# Altium schematic sheet 基于32的人体健康检测系统.SchDoc
size A4
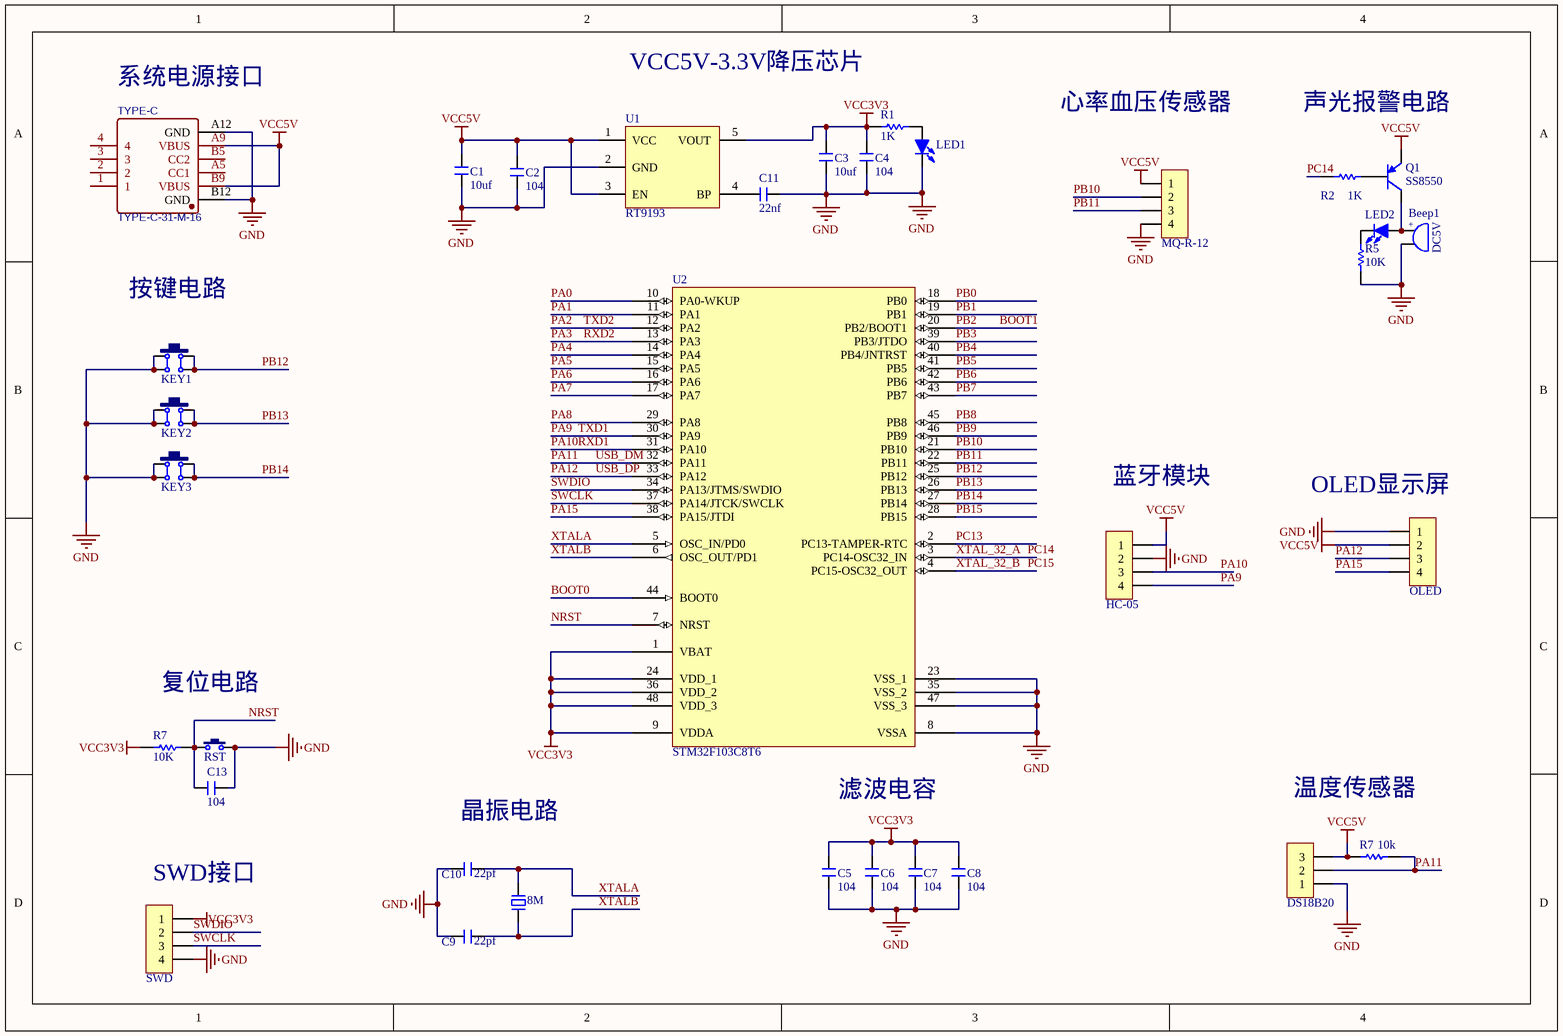
[diagram p0: 基于32的人体健康检测系统.SchDoc]

## Parts
(Parts that share a designator on the sheet are numbered #1, #2 ... from top to bottom, then left to right.)
8M  (no value)  [XTAL-2X6]
Beep1  DC5V  [BEEP 5x9x5.5]
C1  10uf  [C 0603]
C2  104  [C 0603]
C3  10uf  [C 0603]
C4  104  [C 0603]
C5  104  [C 0603]
C6  104  [C 0603]
C7  104  [C 0603]
C8  104  [C 0603]
C9  22pf  [C 0603]
C10  22pf  [C 0603]
C11  22nf  [C 0603]
C13  104  [C 0603]
DS18B20  HDR-1X3  [HDR-1X3]  (value not drawn)
HC-05  HDR-1X4  [HDR-1X4]  (value not drawn)
KEY1  6x6x5  [TSW DIP-6*6*6]  (value not drawn)
KEY2  6x6x5  [TSW DIP-6*6*6]  (value not drawn)
KEY3  6x6x5  [TSW DIP-6*6*6]  (value not drawn)
LED1  (no value)  [LED 0603G]
LED2  (no value)  [I-LED-3MM]
MQ-R-12  HDR-1X4  [HDR-1X4]  (value not drawn)
OLED  HDR-1X4  [OLED_IIC]  (value not drawn)
Q1  SS8550  [TO92A]
R1  1K  [R 0603]
R2  1K  [AL0204]
R5  10K  [AL0204]
R7#1  10K  [R 0603]
R7#2  10k  [AL0204]
RST  3x6x5  [TSW SMD-3*4*2]  (value not drawn)
SWD  HDR-1X4  [HDR-1X4]  (value not drawn)
TYPE-C  TYPE-C-31-M-16  [Type-c-5P]
U1  RT9193  [SOT23-5M]
U2  STM32F103C8T6  [LQFP48 7X7_M]

## Nets
GND: Beep1.2 C1.2 C2.2 C3.2 C4.2 C5.2 C6.2 C7.2 C8.2 C9.1 C10.1 C11.2 C13.1 DS18B20.1 HC-05.2 KEY1.1 KEY1.4 KEY2.1 KEY2.4 KEY3.1 KEY3.4 LED1.2(K) MQ-R-12.4 OLED.1 R5.2 RST.2 SWD.4 TYPE-C.A12(GND) TYPE-C.B12(GND) U1.2(GND) U2.8(VSSA) U2.23(VSS_1) U2.35(VSS_2) U2.47(VSS_3)
VCC3V3: C3.1 C4.1 C5.1 C6.1 C7.1 C8.1 R1.1 R7#1.1 SWD.1 U1.5(VOUT) U2.1(VBAT) U2.9(VDDA) U2.24(VDD_1) U2.36(VDD_2) U2.48(VDD_3)
VCC5V: C1.1 C2.1 DS18B20.3 HC-05.1 MQ-R-12.1 OLED.2 Q1.1(E) R7#2.2 TYPE-C.A9(VBUS) TYPE-C.B9(VBUS) U1.1(VCC) U1.3(EN)
BOOT0: U2.44(BOOT0)
BOOT1: U2.20(PB2/BOOT1)  [also labelled PB2]
NRST: C13.2 R7#1.2 RST.1 U2.7(NRST)
PA0: U2.10(PA0-WKUP)
PA1: U2.11(PA1)
PA2: U2.12(PA2)  [also labelled TXD2]
PA3: U2.13(PA3)  [also labelled RXD2]
PA4: U2.14(PA4)
PA5: U2.15(PA5)
PA6: U2.16(PA6)
PA7: U2.17(PA7)
PA8: U2.29(PA8)
PA9: HC-05.4 U2.30(PA9)  [also labelled TXD1]
PA10: HC-05.3 U2.31(PA10)  [also labelled RXD1]
PA11: DS18B20.2 R7#2.1 U2.32(PA11)  [also labelled USB_DM]
PA12: OLED.3 U2.33(PA12)  [also labelled USB_DP]
PA15: OLED.4 U2.38(PA15/JTDI)
PB0: U2.18(PB0)
PB1: U2.19(PB1)
PB3: U2.39(PB3/JTDO)
PB4: U2.40(PB4/JNTRST)
PB5: U2.41(PB5)
PB6: U2.42(PB6)
PB7: U2.43(PB7)
PB8: U2.45(PB8)
PB9: U2.46(PB9)
PB10: MQ-R-12.2 U2.21(PB10)
PB11: MQ-R-12.3 U2.22(PB11)
PB12: KEY1.2 KEY1.3 U2.25(PB12)
PB13: KEY2.2 KEY2.3 U2.26(PB13)
PB14: KEY3.2 KEY3.3 U2.27(PB14)
PB15: U2.28(PB15)
PC13: U2.2(PC13-TAMPER-RTC)
PC14: R2.2 U2.3(PC14-OSC32_IN)  [also labelled XTAL_32_A]
PC15: U2.4(PC15-OSC32_OUT)  [also labelled XTAL_32_B]
SWCLK: SWD.3 U2.37(PA14/JTCK/SWCLK)
SWDIO: SWD.2 U2.34(PA13/JTMS/SWDIO)
XTALA: 8M.2 C10.2 U2.5(OSC_IN/PD0)
XTALB: 8M.1 C9.2 U2.6(OSC_OUT/PD1)
NetBeep1_1: Beep1.1 LED2.1(A) Q1.3(C)
NetC11_1: C11.1 U1.4(BP)
NetLED1_1: LED1.1(A) R1.2
NetLED2_2: LED2.2(K) R5.1
NetQ1_2: Q1.2(B) R2.1

Not connected (* = marked no-connect by the designer): TYPE-C 1 2 3 4 A5(CC1) B5(CC2)

## Notes on the sheet
- (near TYPE-C) 系统电源接口
- VCC5V-3.3V降压芯片
- 心率血压传感器
- 声光报警电路
- 按键电路
- 蓝牙模块
- (near OLED) OLED显示屏
- 复位电路
- (near C10) 晶振电路
- 滤波电容
- 温度传感器
- (near SWD) SWD接口
- (in symbol BEEP) +

## Library data of the parts
8M = XTAL-2: 2脚晶振; 版权归属: 源创客; BOM名称: 2脚晶振; 学习资源: www.ooocke.com
Beep1 = BEEP: 蜂鸣器; 版权归属: 源创客; BOM名称: 蜂鸣器; 学习资源: www.ooocke.com
C1-C11 C13 = C: 无极性贴片电容; 版权归属: 源创客; BOM名称: 无极性贴片电容; 学习资源: www.ooocke.com
DS18B20 = Header 3: 3P接插件; 版权归属: 源创客; BOM名称: 3P接插件; 学习资源: www.ooocke.com
HC-05 MQ-R-12 OLED SWD = Header 4: 4P接插件; 版权归属: 源创客; BOM名称: 4P接插件; 学习资源: www.ooocke.com
KEY1-KEY3 = TSW DIP-6x6: 直插6x6轻触开关; 版权归属: 源创客; BOM名称: 直插6x6轻触开关; 学习资源: www.ooocke.com
LED1 LED2 = LED-SMD: 贴片LED; 版权归属: 源创客; BOM名称: 贴片LED; 学习资源: www.ooocke.com
Q1 = 8550-DIP: 高频放大-PNP型; 版权归属: 源创客; 属性: 40V 1.5A 1W 100MHZ; BOM名称: 高频放大-PNP型; 学习资源: www.ooocke.com
R1 R7#1 = R: 贴片电阻; 版权归属: 源创客; BOM名称: 贴片电阻; 学习资源: www.ooocke.com
R2 R5 R7#2 = Res: 美标电阻
RST = TSW 3x6: 3x6轻触开关; 版权归属: 源创客; BOM名称: 3x6轻触开关; 学习资源: www.ooocke.com
U1 = RT9193: 电源芯片
U2 = STM32F103C8T6: Flaah:64/RAM:20/IO:36; BOM名称: 32位STM单片机; 版权归属: 源创客; 学习资源: www.ooocke.com